# EAGLE schematic EvapSharkFeather (EAGLE 8.3.2)
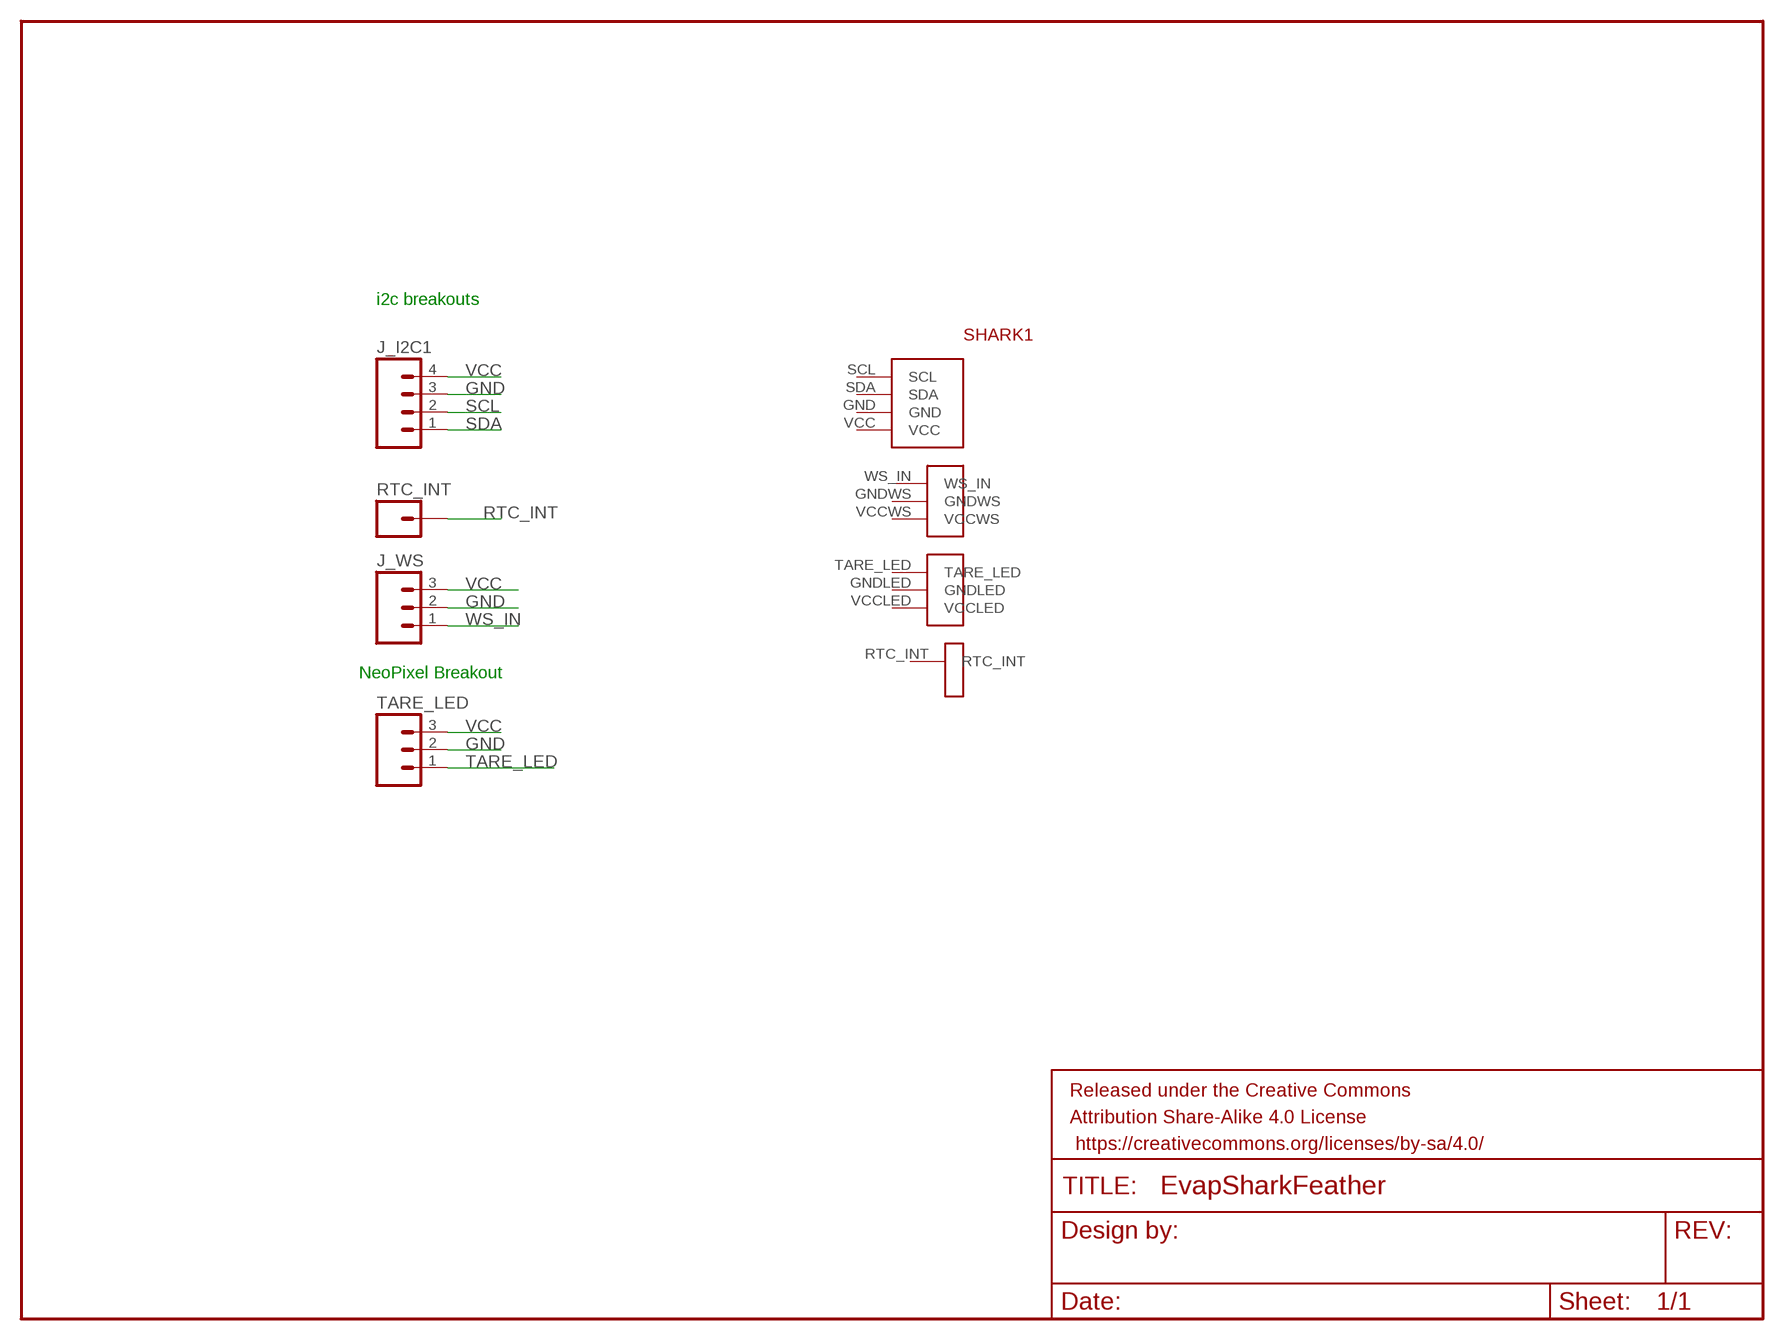
[diagram p0: schematic, sheet 1]

## Parts
FRAME1  FRAME-LETTER  [CREATIVE_COMMONS]
J_I2C1  M04PTH  [1X04]
J_WS  M03PTH  [1X03]
RTC_INT  M01PTH  [1X01]
SHARK1  EVAPSHARK  [EVAPSHARK]
TARE_LED  M03PTH  [1X03]

## Nets
GND: J_I2C1.3 J_WS.2 TARE_LED.2
RTC_INT: RTC_INT.1
SCL: J_I2C1.2
SDA: J_I2C1.1
TARE_LED: TARE_LED.1
VCC: J_I2C1.4 J_WS.3 TARE_LED.3
WS_IN: J_WS.1
Unconnected: SHARK1.RTC_INT SHARK1.SCL SHARK1.SDA SHARK1.TARE_LED SHARK1.WS_IN

## Notes on the sheet
- i2c breakouts
- NeoPixel Breakout

## Power pins joined to a net without a drawn wire
GND: SHARK1.GND
GNDLED: SHARK1.GNDLED
GNDWS: SHARK1.GNDWS
VCC: SHARK1.VCC
VCCLED: SHARK1.VCCLED
VCCWS: SHARK1.VCCWS

## Library data of the parts
FRAME1 = SparkFun-Aesthetics:FRAME-LETTER: Schematic Frame Standard 8.5x11 US Letter frame
J_I2C1 = SparkFun-Connectors:M04: Header 4 Standard 4-pin 0.1" header. Use with straight break away headers (SKU : PRT-00116), right angle break away headers (PRT-00553), swiss pins (PRT-00743), machine pins (PRT-00117), and female headers (PRT-00115). Molex polarized connector foot print use with SKU : PRT-08231 with associated crimp pins and housings. 1MM SMD Version SKU: PRT-10208; PROD_ID: CONN-09696
J_WS TARE_LED = SparkFun-Connectors:M03: Header 3 Standard 3-pin 0.1" header. Use with straight break away headers (SKU : PRT-00116), right angle break away headers (PRT-00553), swiss pins (PRT-00743), machine pins (PRT-00117), and female headers (PRT-00115). Molex polarized connector foot print use with SKU : PRT-08232 with associated crimp pins and housings.
RTC_INT = SparkFun-Connectors:M01: Header 1 Standard 1-pin 0.1" header. Use with straight break away headers (SKU : PRT-00116), right angle break away headers (PRT-00553), swiss pins (PRT-00743), machine pins (PRT-00117), and female headers (PRT-00115). SMTSO-256-ET is a "flush mount" nut for a 4-40 screw. The older package used to be too tight, and did not allow it to sit properly thru the drill hit. The latest (0.165DIA) fits nice and snug.
SHARK1 = WeatherShark:EVAPSHARK: EvapShark foot print for the weathershark